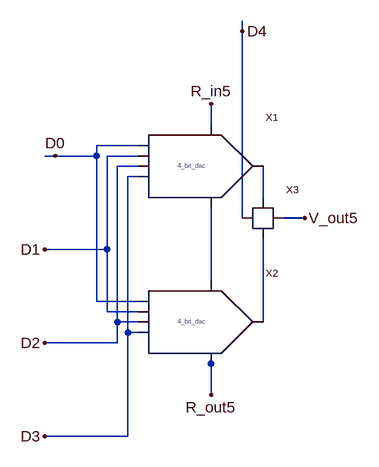
[diagram p0: schematic 5_bit_dac.asc]
5_bit_dac.asc, the LTspice schematic file:
Version 4
SHEET 1 880 680
WIRE 464 -128 464 -144
WIRE 416 16 416 -16
WIRE 304 48 240 48
WIRE 176 64 160 64
WIRE 240 64 240 48
WIRE 240 64 176 64
WIRE 304 64 256 64
WIRE 304 80 272 80
WIRE 304 96 288 96
WIRE 496 128 496 80
WIRE 464 160 464 -128
WIRE 560 160 528 160
WIRE 256 208 256 64
WIRE 256 208 160 208
WIRE 416 256 416 144
WIRE 240 288 240 64
WIRE 304 288 240 288
WIRE 256 304 256 208
WIRE 304 304 256 304
WIRE 272 320 272 80
WIRE 304 320 272 320
WIRE 496 320 496 192
WIRE 288 336 288 96
WIRE 304 336 288 336
WIRE 272 352 272 320
WIRE 272 352 160 352
WIRE 416 384 416 368
WIRE 416 432 416 384
WIRE 288 496 288 336
WIRE 288 496 160 496
FLAG 560 160 V_out5
FLAG 176 64 D0
FLAG 160 208 D1
FLAG 160 352 D2
FLAG 160 496 D3
FLAG 416 432 R_out5
FLAG 416 -16 R_in5
FLAG 464 -128 D4
SYMBOL switch 496 160 R0
SYMATTR InstName X3
SYMBOL 4_bit_dac 352 80 R0
SYMATTR InstName X1
SYMBOL 4_bit_dac 352 320 R0
SYMATTR InstName X2

The netlist it stands for:
* 5_bit_dac.asc
XX3 D4 N001 N003 V_out5 switch  ; pins digital_input Vin_1 Vin_2 Vout
XX1 D0 D1 D2 D3 N001 R_in5 N002 4_bit_dac  ; pins D0 D1 D2 D3 V_out4 R_in4 R_out4
XX2 D0 D1 D2 D3 N003 N002 R_out5 4_bit_dac  ; pins D0 D1 D2 D3 V_out4 R_in4 R_out4
.backanno
.end